# Altium project balenaFin_v1_x_x.PrjPcb (part 3 of 3)
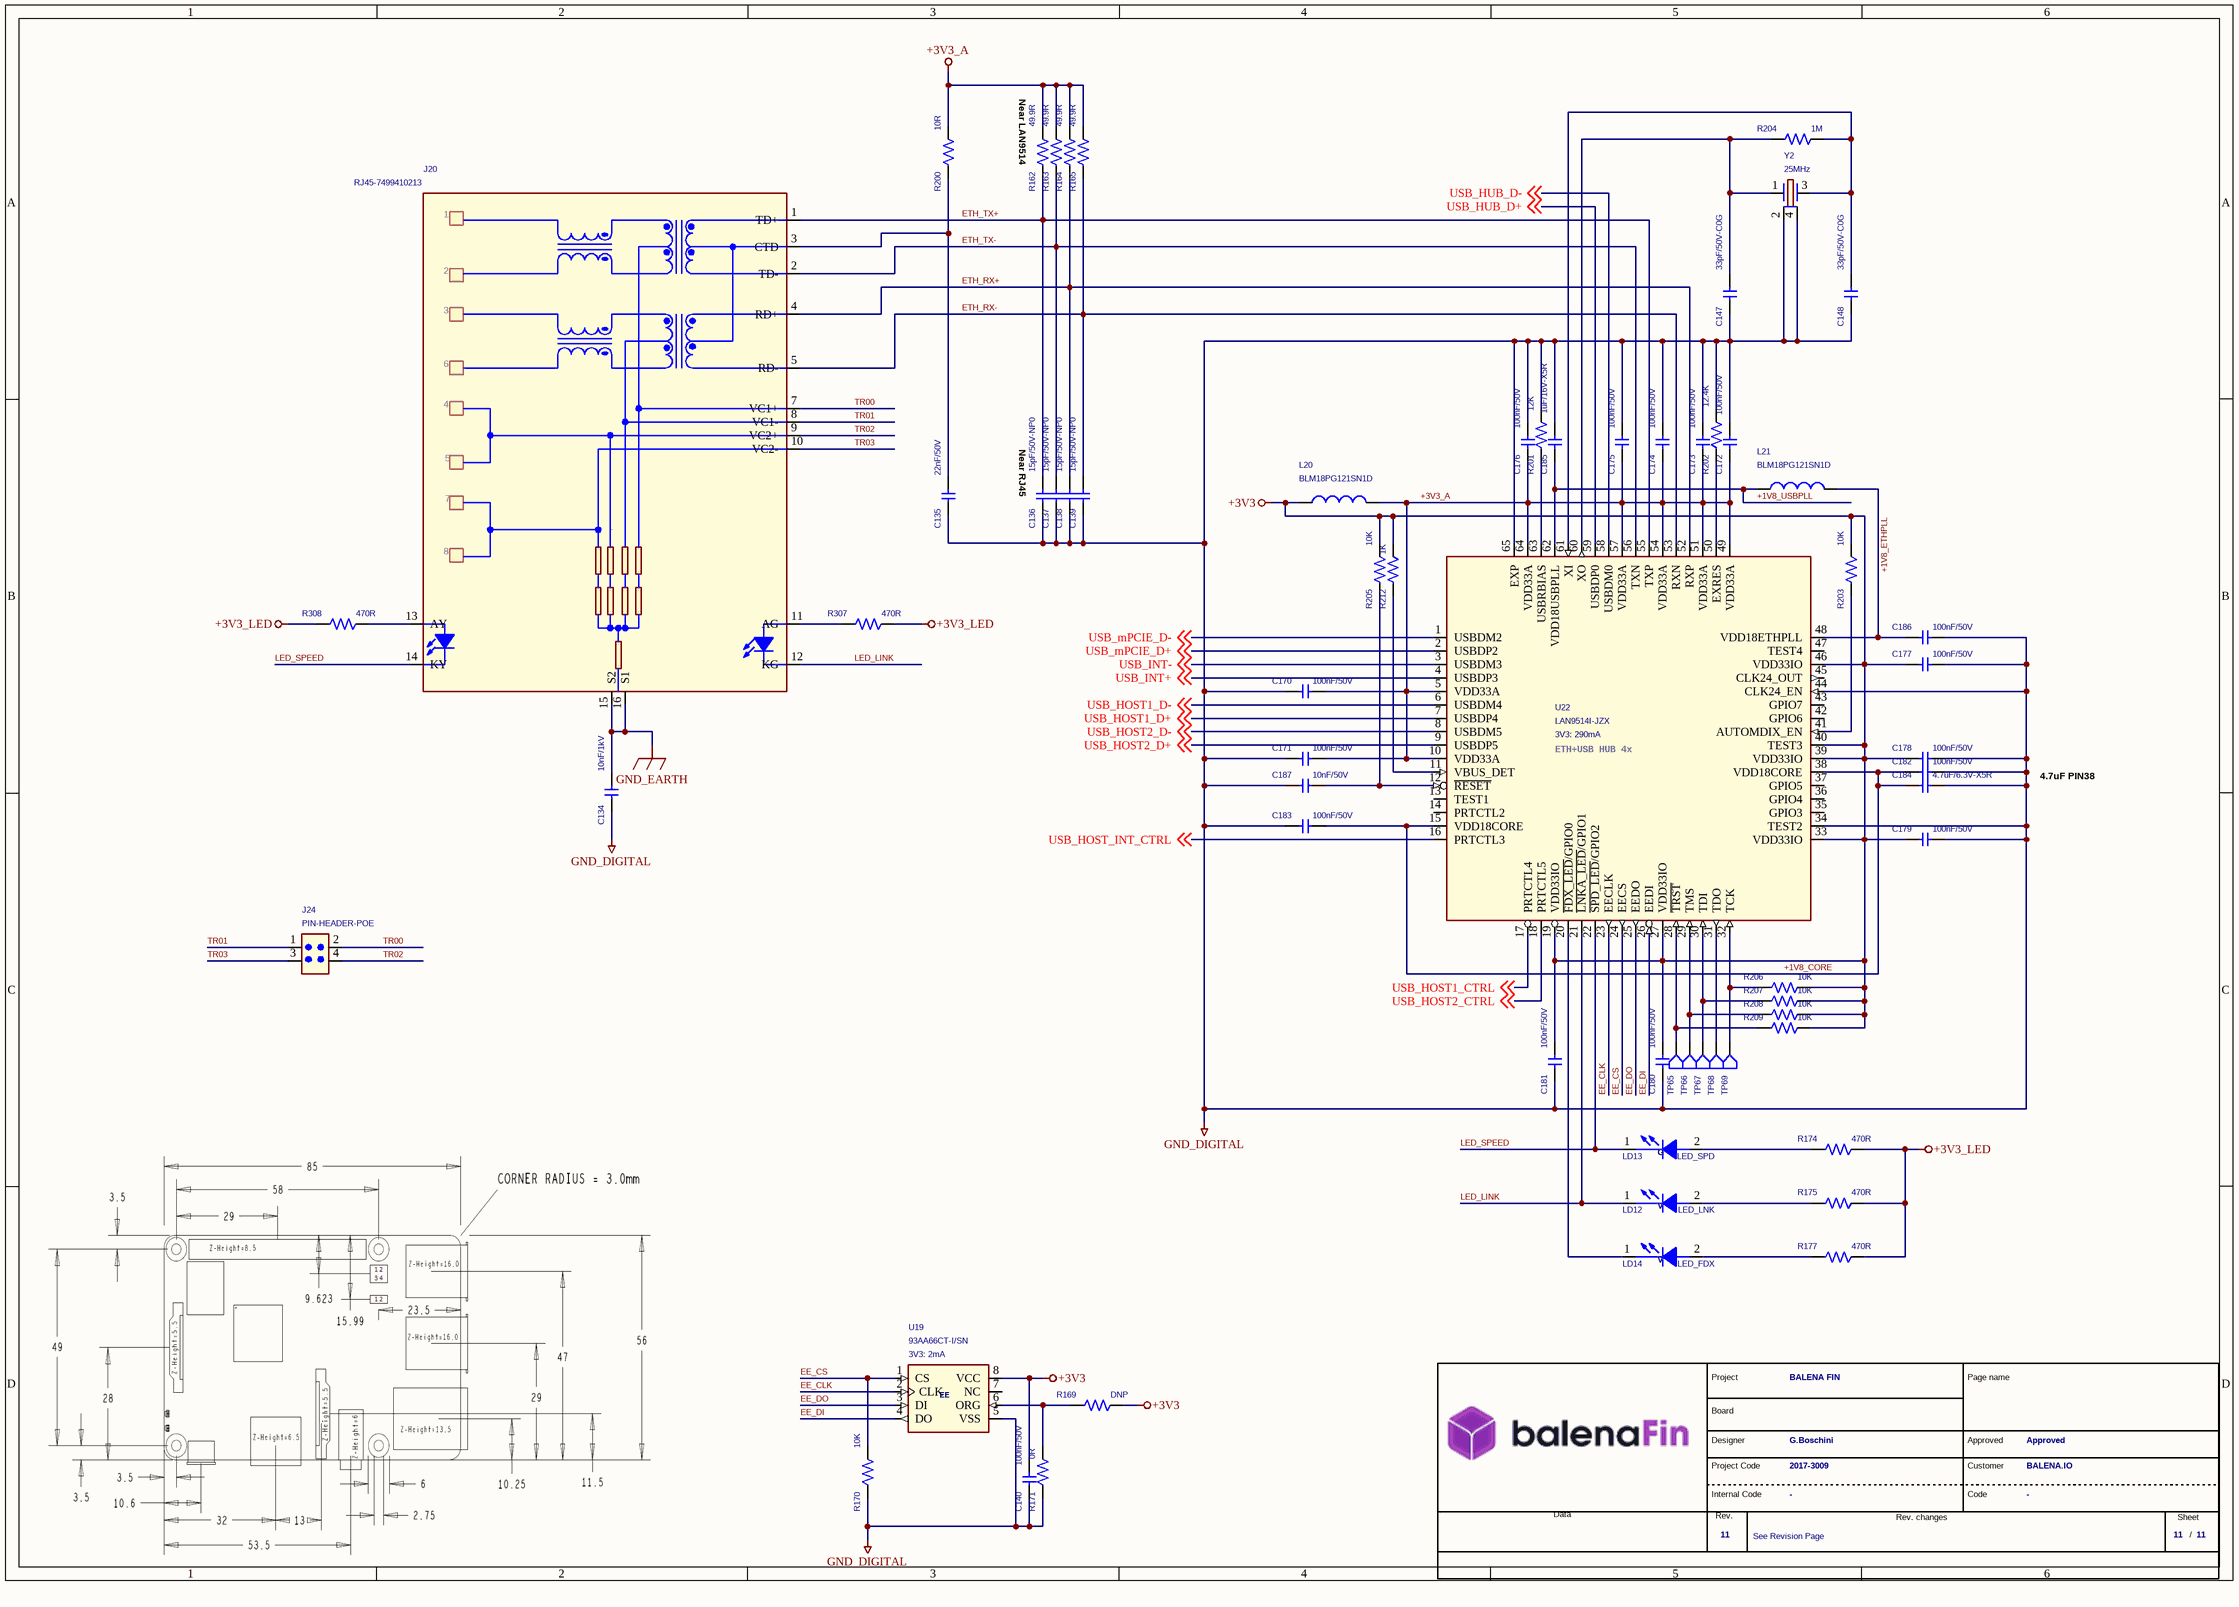
[diagram p13: 10 - ETHERNET.SchDoc]

## Nets that join several sheets
+1V5: 02 - POWER (C42.1 R49.2 U6.4), 09 - mPCIE (7 pins)
+1V8: 01 - CML3 CONNECTOR (10 pins), 02 - POWER (C39.1 R42.2 U5.4), 03 - WIFI - BLE (C231.1 Y5.4)
+2V8: 01 - CML3 CONNECTOR (C17.2 C18.1 J2.189 J2.190), 02 - POWER (C27.1 R35.2 U2.4)
+3V3: 01 - CML3 CONNECTOR (33 pins), 02 - POWER (18 pins), 03 - WIFI - BLE (20 pins), 04 - MIPI INTERFACE (23 pins), 05 - USB (C85.1 R113.1 U13.9), 06 - MCU (8 pins), 07 - eMMC (19 pins), 08 - HAT (C113.1 F3.1), 09 - mPCIE (18 pins), 10 - ETHERNET (22 pins)
+3V3_LED: 01 - CML3 CONNECTOR (LD17.2), 02 - POWER (LD5.2 Q16.4 R267.2), 09 - mPCIE (LD9.2 LD10.2 LD11.2), 10 - ETHERNET (5 pins)
+3V3_ON: 01 - CML3 CONNECTOR (R183.1), 02 - POWER (11 pins), 06 - MCU (31 pins)
+5V: 01 - CML3 CONNECTOR (C188.1 R244.1 U23.8), 02 - POWER (14 pins), 06 - MCU (LD8.4 LD8.5 LD8.6), 08 - HAT (C114.1 F4.2), 09 - mPCIE (TVS17.5)
+5V_DEV: 01 - CML3 CONNECTOR (R243.1), 02 - POWER (Q17.4 R268.2), 05 - USB (6 pins)
+5V_USB_DBG: 01 - CML3 CONNECTOR (R237.2), 02 - POWER (DS33.2), 05 - USB (5 pins)
GND_DIGITAL: 01 - CML3 CONNECTOR (103 pins), 02 - POWER (58 pins), 03 - WIFI - BLE (44 pins), 04 - MIPI INTERFACE (46 pins), 05 - USB (45 pins), 06 - MCU (40 pins), 07 - eMMC (19 pins), 08 - HAT (12 pins), 09 - mPCIE (48 pins), 10 - ETHERNET (37 pins)
GND_EARTH: 05 - USB (6 pins), 10 - ETHERNET (C134.2 J20.15 J20.16)
BT_PCM_CLK: 03 - WIFI - BLE (MOD1.C1), 04 - MIPI INTERFACE (R7.2 U33.6)
BT_PCM_CLK_I2C_SDA: 01 - CML3 CONNECTOR (R8.2), 04 - MIPI INTERFACE (U33.7)
BT_PCM_IN: 01 - CML3 CONNECTOR (R12.2), 03 - WIFI - BLE (MOD1.D1)
BT_PCM_OUT: 01 - CML3 CONNECTOR (R11.2), 03 - WIFI - BLE (MOD1.C2)
BT_PCM_SYNC: 03 - WIFI - BLE (MOD1.D2), 04 - MIPI INTERFACE (R10.2 U33.3)
BT_PCM_SYNC_I2C_SCL: 01 - CML3 CONNECTOR (R9.2), 04 - MIPI INTERFACE (U33.4)
CAM0_CN: 01 - CML3 CONNECTOR (J2.144), 04 - MIPI INTERFACE (U31.14)
CAM0_CP: 01 - CML3 CONNECTOR (J2.142), 04 - MIPI INTERFACE (U31.15)
CAM0_DN0: 01 - CML3 CONNECTOR (J2.138), 04 - MIPI INTERFACE (U31.12)
CAM0_DN1: 01 - CML3 CONNECTOR (J2.150), 04 - MIPI INTERFACE (U31.16)
CAM0_DP0: 01 - CML3 CONNECTOR (J2.136), 04 - MIPI INTERFACE (U31.13)
CAM0_DP1: 01 - CML3 CONNECTOR (J2.148), 04 - MIPI INTERFACE (U31.17)
CAM1_CN: 01 - CML3 CONNECTOR (J2.149), 04 - MIPI INTERFACE (L13.4)
CAM1_CP: 01 - CML3 CONNECTOR (J2.147), 04 - MIPI INTERFACE (L13.3)
CAM1_DN0: 01 - CML3 CONNECTOR (J2.161), 04 - MIPI INTERFACE (L11.4)
CAM1_DN1: 01 - CML3 CONNECTOR (J2.155), 04 - MIPI INTERFACE (L12.4)
CAM1_DP0: 01 - CML3 CONNECTOR (J2.159), 04 - MIPI INTERFACE (L11.3)
CAM1_DP1: 01 - CML3 CONNECTOR (J2.153), 04 - MIPI INTERFACE (L12.3)
CAM1_IO0: 01 - CML3 CONNECTOR (J2.82 R18.2), 04 - MIPI INTERFACE (DS4.3 R82.2)
CAM1_IO1: 01 - CML3 CONNECTOR (J2.84 R20.2), 04 - MIPI INTERFACE (DS4.6 R84.2)
CM3_RX: 01 - CML3 CONNECTOR (R15.2), 06 - MCU (U29.2)
CM3_TX: 01 - CML3 CONNECTOR (R14.2), 06 - MCU (U29.1)
DSI1_CN: 01 - CML3 CONNECTOR (J2.102), 04 - MIPI INTERFACE (U31.23)
DSI1_CP: 01 - CML3 CONNECTOR (J2.100), 04 - MIPI INTERFACE (U31.22)
DSI1_DN0: 01 - CML3 CONNECTOR (J2.96), 04 - MIPI INTERFACE (U31.21)
DSI1_DN1: 01 - CML3 CONNECTOR (J2.120), 04 - MIPI INTERFACE (U31.18)
DSI1_DP0: 01 - CML3 CONNECTOR (J2.94), 04 - MIPI INTERFACE (U31.20)
DSI1_DP1: 01 - CML3 CONNECTOR (J2.118), 04 - MIPI INTERFACE (U31.19)
eMMC_CLK: 01 - CML3 CONNECTOR (J2.10), 07 - eMMC (U17.M6 U17.N7 U17.P7)
eMMC_CMD: 01 - CML3 CONNECTOR (J2.12), 07 - eMMC (5 pins)
eMMC_D0: 01 - CML3 CONNECTOR (J2.16), 07 - eMMC (R138.1 U17.A3)
eMMC_D1: 01 - CML3 CONNECTOR (J2.18), 07 - eMMC (R137.1 U17.A4)
eMMC_D2: 01 - CML3 CONNECTOR (J2.22), 07 - eMMC (R136.1 U17.A5)
eMMC_D3: 01 - CML3 CONNECTOR (J2.24), 07 - eMMC (R135.1 U17.A1 U17.B2)
GPIO4: 01 - CML3 CONNECTOR (J2.15), 08 - HAT (J18.7)
GPIO5: 01 - CML3 CONNECTOR (J2.17), 08 - HAT (J18.29)
GPIO6: 01 - CML3 CONNECTOR (J2.21), 08 - HAT (J18.31)
GPIO7: 01 - CML3 CONNECTOR (J2.23), 08 - HAT (J18.26)
GPIO8: 01 - CML3 CONNECTOR (J2.27), 08 - HAT (J18.24)
GPIO9: 01 - CML3 CONNECTOR (J2.29), 08 - HAT (J18.21)
GPIO10: 01 - CML3 CONNECTOR (J2.33), 08 - HAT (J18.19)
GPIO11: 01 - CML3 CONNECTOR (J2.35), 08 - HAT (J18.23)
GPIO12: 01 - CML3 CONNECTOR (J2.45), 08 - HAT (J18.32)
GPIO13: 01 - CML3 CONNECTOR (J2.47), 08 - HAT (J18.33)
GPIO14: 01 - CML3 CONNECTOR (J2.51), 08 - HAT (J18.8)
GPIO15: 01 - CML3 CONNECTOR (J2.53), 08 - HAT (J18.10)
GPIO16: 01 - CML3 CONNECTOR (J2.57), 08 - HAT (J18.36)
GPIO17: 01 - CML3 CONNECTOR (J2.59), 08 - HAT (J18.11)
GPIO18: 01 - CML3 CONNECTOR (J2.63), 08 - HAT (J18.12)
GPIO19: 01 - CML3 CONNECTOR (J2.65), 08 - HAT (J18.35)
GPIO20: 01 - CML3 CONNECTOR (J2.69), 08 - HAT (J18.38)
GPIO21: 01 - CML3 CONNECTOR (J2.71), 08 - HAT (J18.40)
GPIO22: 01 - CML3 CONNECTOR (J2.75), 08 - HAT (J18.15)
GPIO23: 01 - CML3 CONNECTOR (J2.77), 08 - HAT (J18.16)
GPIO24: 01 - CML3 CONNECTOR (J2.81), 08 - HAT (J18.18)
GPIO25: 01 - CML3 CONNECTOR (J2.83), 08 - HAT (J18.22)
GPIO26: 01 - CML3 CONNECTOR (J2.87), 08 - HAT (J18.37)
GPIO27: 01 - CML3 CONNECTOR (J2.89), 08 - HAT (J18.13)
HDMI_LS_OE: 01 - CML3 CONNECTOR (R13.1 R16.1 R245.2), 06 - MCU (U25.5)
I2C0_SCL: 01 - CML3 CONNECTOR (J2.5 R4.1), 04 - MIPI INTERFACE (DS5.6 R86.2), 08 - HAT (J18.28)
I2C0_SDA: 01 - CML3 CONNECTOR (J2.3 R5.1), 04 - MIPI INTERFACE (DS5.3 R88.2), 08 - HAT (J18.27)
I2C1_SCL: 01 - CML3 CONNECTOR (J2.11 R1.1), 06 - MCU (R284.2), 08 - HAT (J18.5), 09 - mPCIE (R143.2)
I2C1_SDA: 01 - CML3 CONNECTOR (J2.9 R3.1), 06 - MCU (R285.1), 08 - HAT (J18.3), 09 - mPCIE (R145.2)
PERST_mPCIE: 06 - MCU (U25.8), 09 - mPCIE (R250.2)
PW_EN_LED: 02 - POWER (Q13.1 Q16.1 R273.1), 06 - MCU (U25.10)
PW_ON_3V3: 02 - POWER (R180.1 U20.3), 06 - MCU (MOD2.26)
PW_ON_5V: 02 - POWER (Q17.1 R274.1), 06 - MCU (MOD2.17)
SEL_SWD: 01 - CML3 CONNECTOR (J2.72), 06 - MCU (R297.1 R298.2 U29.10)
SW_I2C_SCL_ON: 01 - CML3 CONNECTOR (U23.6), 06 - MCU (7 pins)
SW_I2C_SCL_ON_OFF: 01 - CML3 CONNECTOR (R17.2), 06 - MCU (Q18.4 R282.2 R287.1 U25.12)
SW_I2C_SDA_ON: 01 - CML3 CONNECTOR (U23.5), 06 - MCU (7 pins)
SW_I2C_SDA_ON_OFF: 01 - CML3 CONNECTOR (R19.2), 06 - MCU (Q18.1 R283.1 R286.2 U25.13)
USB_DM: 01 - CML3 CONNECTOR (J2.167), 05 - USB (U13.2)
USB_DP: 01 - CML3 CONNECTOR (J2.165), 05 - USB (U13.1)
USB_HOST1_CTRL: 05 - USB (U10.3 U10.4), 10 - ETHERNET (U22.17)
USB_HOST1_D+: 05 - USB (R91.1), 10 - ETHERNET (U22.7)
USB_HOST1_D-: 05 - USB (R92.1), 10 - ETHERNET (U22.6)
USB_HOST2_CTRL: 05 - USB (U12.3 U12.4), 10 - ETHERNET (U22.18)
USB_HOST2_D+: 05 - USB (R109.1), 10 - ETHERNET (U22.9)
USB_HOST2_D-: 05 - USB (R108.1), 10 - ETHERNET (U22.8)
USB_HOST_INT_CTRL: 05 - USB (U28.3 U28.4), 10 - ETHERNET (U22.16)
USB_HUB_D+: 05 - USB (U13.7), 10 - ETHERNET (U22.59)
USB_HUB_D-: 05 - USB (U13.6), 10 - ETHERNET (U22.58)
USB_INT+: 05 - USB (R296.1), 10 - ETHERNET (U22.4)
USB_INT-: 05 - USB (R295.1), 10 - ETHERNET (U22.3)
USB_mPCIE_D+: 09 - mPCIE (J19.38 TVS17.2), 10 - ETHERNET (U22.2)
USB_mPCIE_D-: 09 - mPCIE (J19.36 TVS17.1), 10 - ETHERNET (U22.1)
W-DISABLE_mPCIE: 06 - MCU (U25.7), 09 - mPCIE (R249.2)
WIFI_BLE_PDN: 01 - CML3 CONNECTOR (R293.2), 03 - WIFI - BLE (MOD1.C8 R218.2)
WIFI_SDIO_CLK: 01 - CML3 CONNECTOR (J2.52), 03 - WIFI - BLE (MOD1.A5 RR15.6)
WIFI_SDIO_CMD: 01 - CML3 CONNECTOR (J2.54), 03 - WIFI - BLE (MOD1.B4 RR15.5)
WIFI_SDIO_D0: 01 - CML3 CONNECTOR (J2.58), 03 - WIFI - BLE (MOD1.B6 RR15.4)
WIFI_SDIO_D1: 01 - CML3 CONNECTOR (J2.60), 03 - WIFI - BLE (MOD1.A6 RR15.3)
WIFI_SDIO_D2: 01 - CML3 CONNECTOR (J2.64), 03 - WIFI - BLE (MOD1.B3 RR15.2)
WIFI_SDIO_D3: 01 - CML3 CONNECTOR (J2.66), 03 - WIFI - BLE (MOD1.A3 RR15.1)